# EAGLE design Single Socket_NoPower (EAGLE 6.3)
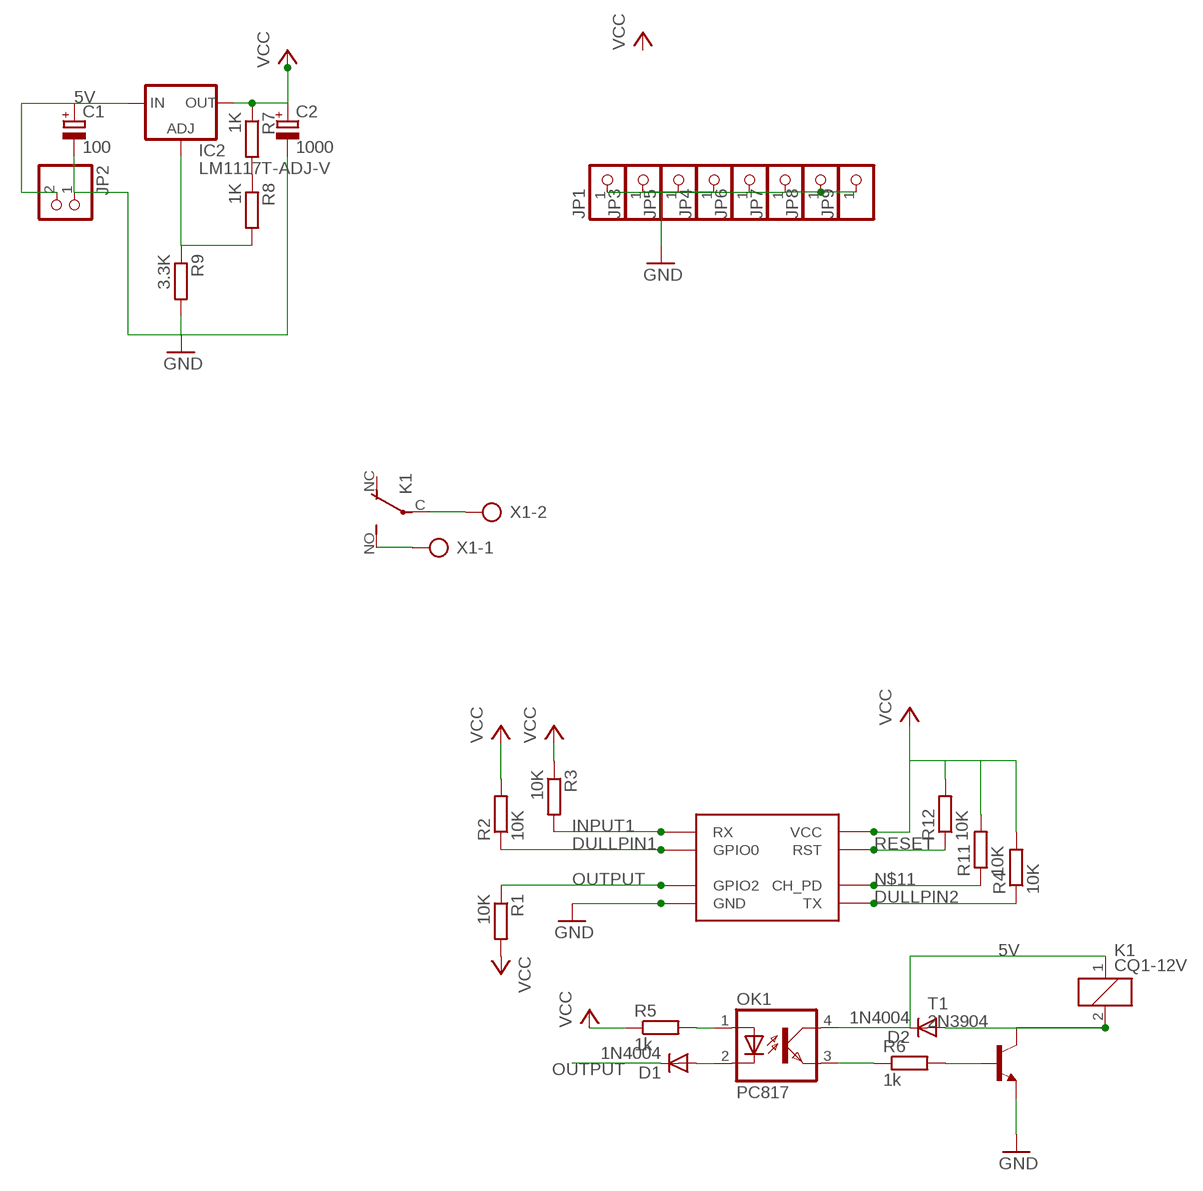
[diagram p0: schematic, sheet 1]

## Parts
C1  100  CPOL-EUE5-10.5  [E5-10,5]
C2  1000  CPOL-EUE5-10.5  [E5-10,5]
D1  1N4004  [DO41-10]
D2  1N4004  [DO41-10]
IC2  LM1117T-ADJ-V  [TO220V]
JP1  PINHD-1X1  [1X01]
JP2  PINHD-1X2  [1X02]
JP3  PINHD-1X1  [1X01]
JP4  PINHD-1X1  [1X01]
JP5  PINHD-1X1  [1X01]
JP6  PINHD-1X1  [1X01]
JP7  PINHD-1X1  [1X01]
JP8  PINHD-1X1  [1X01]
JP9  PINHD-1X1  [1X01]
K1  CQ1-12V  [CQ1]
OK1  PC817  [DIL04]
R1  10K  R-EU_0207/10  [0207/10]
R2  10K  R-EU_0207/10  [0207/10]
R3  10K  R-EU_0207/10  [0207/10]
R4  10K  R-EU_0207/10  [0207/10]
R5  1k  R-EU_0207/10  [0207/10]
R6  1k  R-EU_0207/10  [0207/10]
R7  1K  R-EU_0207/10  [0207/10]
R8  1K  R-EU_0207/10  [0207/10]
R9  3.3K  R-EU_0207/10  [0207/10]
R11  10K  R-EU_0207/10  [0207/10]
R12  10K  R-EU_0207/10  [0207/10]
T1  2N3904  [TO92]
U$2  ESP8266  [ESP8266]
X1  AK500/2-H  [AK500/2-H]

## Nets
5V: C1.+ D2.C IC2.3(IN) JP2.2 K1.1 OK1.4(COL)
DULLPIN1: R2.1 U$2.GPIO0
DULLPIN2: R4.1 U$2.TX
GND: C1.- C2.- JP1.1 JP2.1 JP3.1 JP4.1 JP5.1 JP6.1 JP7.1 JP8.1 JP9.1 R9.2 T1.3(E) U$2.GND
INPUT1: R3.2 U$2.RX
N$1: K1.C(2:P) X1.2
N$2: K1.NO(2:S) X1.1
N$3: OK1.1(A) R5.2
N$4: OK1.3(EMIT) R6.1
N$5: D1.A OK1.2(C)
N$7: R6.2 T1.2(B)
N$8: D2.A K1.2 T1.1(C)
N$11: R11.1 U$2.CH_PD
N$12: R7.2 R8.1
N$13: IC2.1(ADJ) R8.2 R9.1
OUTPUT: D1.C R1.1 U$2.GPIO2
RESET: R12.1 U$2.RST
VCC: C2.+ IC2.2(OUT) R1.2 R2.2 R3.1 R4.2 R5.1 R7.1 R11.2 R12.2 U$2.VCC
Unconnected: K1.NC(2:O)

## Library data of the parts
C1 C2 = rcl:CPOL-EU: POLARIZED CAPACITOR, European symbol
D1 D2 = diode:1N4004: DIODE general purpose rectifier, 1 A
IC2 = lm1117:LM1117T-ADJ
JP1 JP3-JP9 = pinhead:PINHD-1X1: PIN HEADER
JP2 = pinhead:PINHD-1X2: PIN HEADER
K1 = relay:CQ1-12V: AUTOMOTIVE QUIET RELAY NAiS Source: http://www.mew-europe.com/.. en_ds_61208_0000.pdf; OC_FARNELL: unknown; OC_NEWARK: unknown
OK1 = optocoupler:PC817: SHARP OPTO COUPLER; MPN: PC817X4J000F; OC_FARNELL: 9707727; OC_NEWARK: 97K7059
R1-R9 R11 R12 = rcl:R-EU_: RESISTOR, European symbol
T1 = transistor:2N3904: NPN TRANSISTOR
U$2 = Andre:ESP8266
X1 = con-ptr500:AK500/2-H: CONNECTOR Aug. 2004 / PTR Meßtechnik: Die Bezeichnung der Serie AK505 wurde geändert. Es handelt sich hierbei um AK500 in horizontaler Ausführung.

## Board
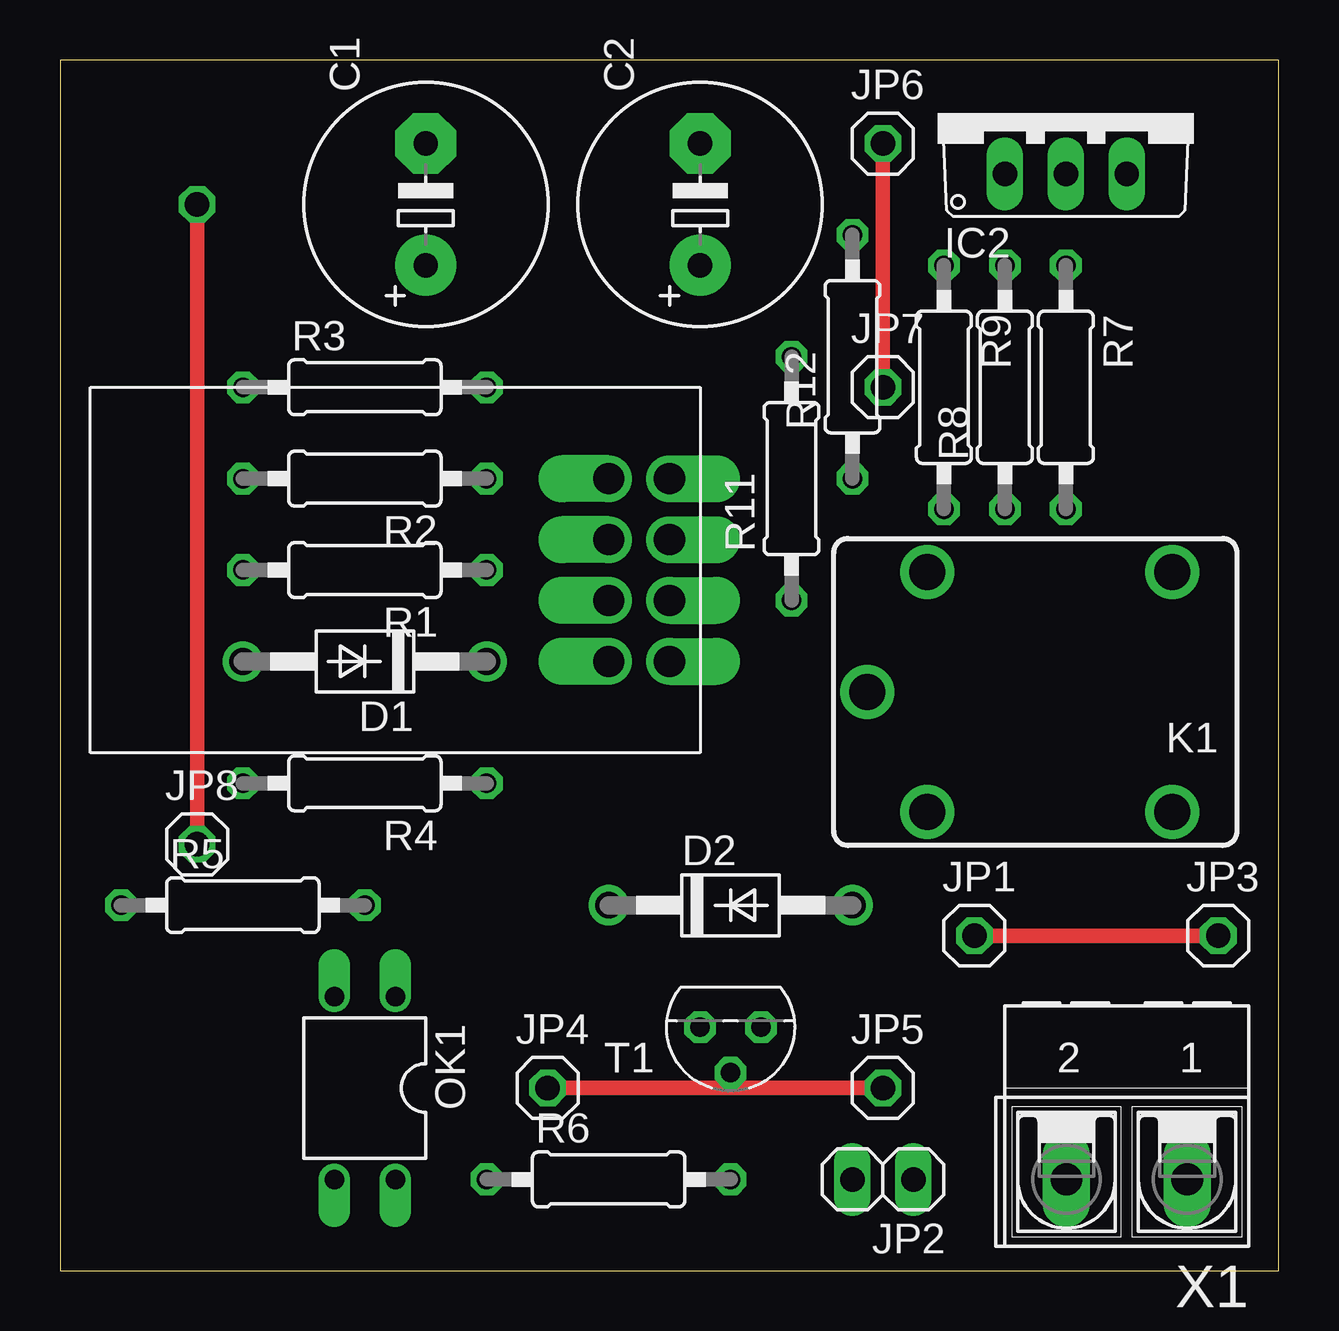
[diagram p1: board, top side]
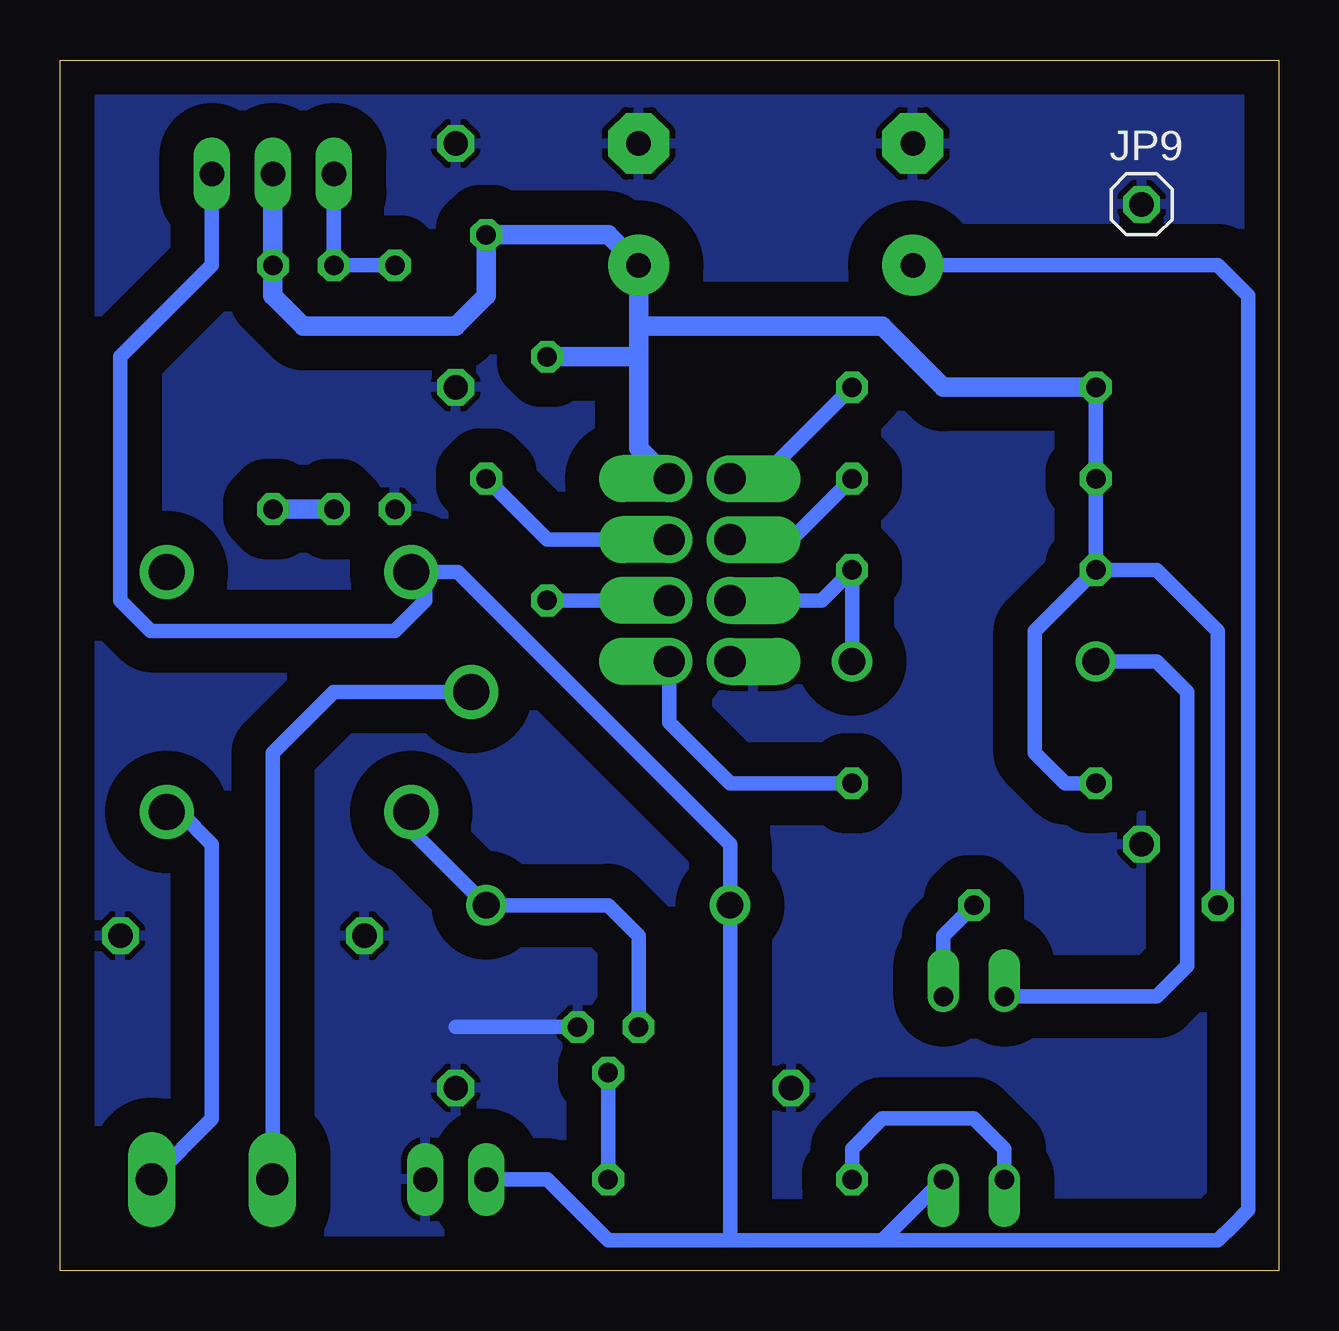
[diagram p2: board, bottom side, seen from below]

Size 50.78 x 50.47 mm. Coordinates in mm from the lower left corner, seen from the top.
Outline: 0,0 50.78,0 50.78,50.47 0,50.47 0,0
Copper layers (1*16): Top 0.035mm / dielectric 1.5mm / Bottom 0.035mm
Design rules "default": minimum track width 10mil, minimum drill 24mil, track to track 8mil, track to pad 8mil, pad to pad 8mil, via to via 8mil, smd to smd 8mil, copper to edge 40mil, drill to drill 8mil, minimum pad ring 10mil, minimum via ring 8mil, stop-mask expansion 4mil, vias tented up to drill 0mil, thermal gap 10mil

### Footprints (pad centres in the part's own frame; a part is rotated, then mirrored left to right if it is on the bottom)
E5-10,5 = drill 1.016 pad 2.54: + -2.54,0 | drill 1.016 pad 2.54 octagon: - 2.54,0
DO41-10 = drill 1.118: A 5.08,0; C -5.08,0
TO220V = drill 1.016 long: 1 -2.54,-2.54; 2 0,-2.54; 3 2.54,-2.54
1X01 = drill 1.016 octagon: 1 0,0
1X02 = drill 1.016 long: 1 -1.27,0; 2 1.27,0
CQ1 = drill 1.5: 1 4.5,-5; 2 4.5,5; C 7,0; NC -5.7,-5; NO -5.7,5
DIL04 = drill 0.813 offset: 1 -1.27,-3.81; 2 1.27,-3.81; 3 1.27,3.81; 4 -1.27,3.81
0207/10 = drill 0.813 octagon: 1 -5.08,0; 2 5.08,0
TO92 = drill 0.813 octagon: 1 1.27,0; 2 0,1.905; 3 -1.27,0
ESP8266 = drill 1.3 offset: CH_PD -1.27,-11.43; GND -3.81,-8.89; GPIO0 1.27,-8.89; GPIO2 -1.27,-8.89; RST 1.27,-11.43; RX 3.81,-8.89; TX -3.81,-11.43; VCC 3.81,-11.43
AK500/2-H = drill 1.321 long: 1 -2.515,0; 2 2.515,0

### Placement (x,y rotation side)
C1  15.24,44.45 90 top
C2  26.67,44.45 90 top
D1  12.7,25.4 180 top
D2  27.94,15.24 0 top
IC2  41.91,48.26 0 top
JP1  38.1,13.97 0 top
JP2  34.29,3.81 180 top
JP3  48.26,13.97 0 top
JP4  20.32,7.62 0 top
JP5  34.29,7.62 0 top
JP6  34.29,46.99 0 top
JP7  34.29,36.83 0 top
JP8  5.71,17.78 0 top
JP9  5.71,44.45 0 bottom
K1  40.64,24.13 180 top
OK1  12.7,7.62 180 top
R1  12.7,29.21 180 top
R2  12.7,33.02 180 top
R3  12.7,36.83 0 top
R4  12.7,20.32 180 top
R5  7.62,15.24 0 top
R6  22.86,3.81 0 top
R7  41.91,36.83 270 top
R8  39.37,36.83 90 top
R9  36.83,36.83 270 top
R11  30.48,33.02 90 top
R12  33.02,38.1 90 top
T1  27.94,10.16 180 top
U$2  13.97,29.21 90 top
X1  44.45,3.81 180 top

### Tracks (layer width: path | path; a pad name or v marks a point on that pad's centre or on a via)
5V
  Bottom 0.61: JP2.2 30.48,3.81 27.94,1.27 22.86,1.27 | 22.86,1.27 16.51,1.27 | 16.51,1.27 OK1.4 | 22.86,1.27 D2.C 22.86,17.78 34.21,29.13 K1.1 | 16.51,1.27 2.54,1.27 1.91,1.91 1.27,2.54 1.27,40.64 2.54,41.91 C1.+ | 36.22,29.21 K1.1 | IC2.3 44.45,41.91 48.26,38.1 48.26,27.94 46.99,26.67 36.83,26.67 35.56,27.94 35.56,28.55 K1.1
DULLPIN1
  Bottom 0.61: U$2.GPIO0 20.32,30.48 R2.1
DULLPIN2
  Bottom 0.61: U$2.TX 25.4,22.86 22.86,20.32 R4.1
GND
  Top 0.61: JP4.1 JP5.1 | JP1.1 JP3.1 | JP6.1 JP7.1 | JP9.1 JP8.1
  Bottom 0.61: T1.3 34.29,10.16
  pour Bottom (isolate 1.422): 0,0 50.8,0 50.8,50.8 0,50.8
INPUT1
  Bottom 0.61: U$2.RX 21.59,33.02 R3.2
N$1
  Bottom 0.61: K1.C 39.37,24.13 41.91,21.59 41.91,3.83 X1.2
N$2
  Bottom 0.61: K1.NO 45.8,19.13 44.45,17.78 44.45,6.33 X1.1
N$3
  Bottom 0.61: R5.2 13.97,13.97 OK1.1
N$4
  Bottom 0.61: R6.1 17.78,5.08 16.51,6.35 12.7,6.35 11.43,5.08 OK1.3
N$5
  Bottom 0.61: OK1.2 5.08,11.43 3.81,12.7 3.81,24.13 5.08,25.4 D1.A
N$7
  Bottom 0.61: R6.2 T1.2
N$8
  Bottom 0.61: T1.1 26.67,13.97 27.94,15.24 D2.A 36.14,18.36 K1.2
N$11
  Bottom 0.61: R11.1 U$2.CH_PD
N$12
  Bottom 0.813: R8.1 R7.2
N$13
  Bottom 0.61: IC2.1 R8.2 R9.1
OUTPUT
  Bottom 0.61: D1.C R1.1 19.05,27.94 U$2.GPIO2
RESET
  Bottom 0.61: U$2.RST 30.48,30.48 R12.1
VCC
  Bottom 0.61: R3.1 R2.2 R1.2 | R1.2 10.16,26.67 10.16,21.59 8.89,20.32 R4.2 | R5.1 2.54,26.67 5.08,29.21 R1.2
  Bottom 0.813: 26.67,38.1 26.67,34.29 U$2.VCC | R11.2 26.67,38.1 | 26.67,38.1 26.67,39.37 | 26.67,39.37 C2.+ 27.94,43.18 R12.2 33.02,40.64 34.29,39.37 40.64,39.37 41.91,40.64 R7.1 IC2.2 | R3.1 13.97,36.83 16.51,39.37 26.67,39.37